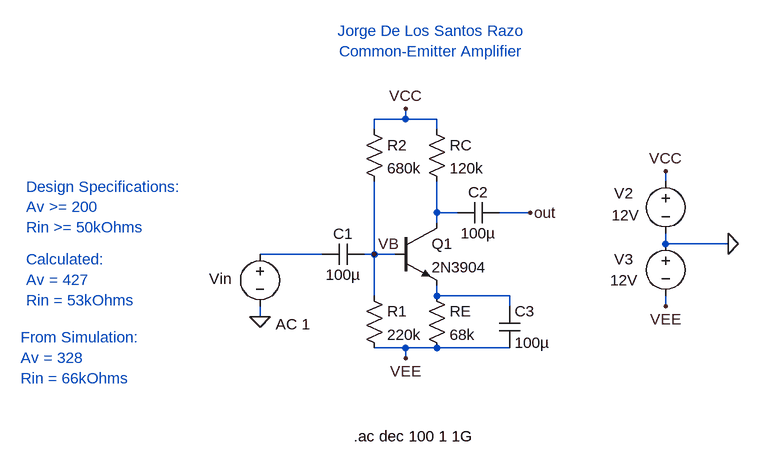
[diagram p0: schematic ce-amplifier.asc]
ce-amplifier.asc, the LTspice schematic file:
Version 4.1
SHEET 1 880 680
WIRE 208 -80 208 -96
WIRE 208 -80 160 -80
WIRE 256 -80 208 -80
WIRE 160 -64 160 -80
WIRE 256 -64 256 -80
WIRE 608 16 608 0
WIRE 256 64 256 16
WIRE 288 64 256 64
WIRE 400 64 352 64
WIRE 256 80 256 64
WIRE 608 112 608 96
WIRE 704 112 608 112
WIRE 80 128 -16 128
WIRE 160 128 160 16
WIRE 160 128 144 128
WIRE 192 128 160 128
WIRE 160 192 160 128
WIRE 256 192 256 176
WIRE 368 192 256 192
WIRE 368 208 368 192
WIRE 608 208 608 192
WIRE -16 224 -16 208
WIRE 208 272 160 272
WIRE 256 272 208 272
WIRE 368 272 256 272
WIRE 208 288 208 272
FLAG -16 224 0
FLAG 208 -96 VCC
FLAG 208 288 VEE
FLAG 608 0 VCC
FLAG 608 208 VEE
FLAG 704 112 0
FLAG 400 64 out
FLAG 160 128 VB
SYMBOL npn 192 80 R0
SYMATTR InstName Q1
SYMATTR Value 2N3904
SYMBOL res 240 -80 R0
SYMATTR InstName RC
SYMATTR Value 120k
SYMBOL res 240 176 R0
SYMATTR InstName RE
SYMATTR Value 68k
SYMBOL res 144 176 R0
SYMATTR InstName R1
SYMATTR Value 220k
SYMBOL res 144 -80 R0
SYMATTR InstName R2
SYMATTR Value 680k
SYMBOL cap 144 112 R90
WINDOW 0 0 32 VBottom 2
WINDOW 3 32 32 VTop 2
SYMATTR InstName C1
SYMATTR Value 100µ
SYMBOL voltage -16 112 R0
WINDOW 0 -78 54 Left 2
WINDOW 123 24 124 Left 2
WINDOW 39 0 0 Left 0
SYMATTR InstName Vin
SYMATTR Value2 AC 1
SYMATTR Value ""
SYMBOL cap 352 48 R90
WINDOW 0 0 32 VBottom 2
WINDOW 3 32 32 VTop 2
SYMATTR InstName C2
SYMATTR Value 100µ
SYMBOL voltage 608 0 R0
WINDOW 0 -79 34 Left 2
WINDOW 3 -83 68 Left 2
SYMATTR InstName V2
SYMATTR Value 12V
SYMBOL voltage 608 96 R0
WINDOW 0 -79 40 Left 2
WINDOW 3 -85 72 Left 2
SYMATTR InstName V3
SYMATTR Value 12V
SYMBOL cap 352 208 R0
SYMATTR InstName C3
SYMATTR Value 100µ
TEXT 248 -200 Center 2 ;Jorge De Los Santos Razo\nCommon-Emitter Amplifier
TEXT -376 24 Left 2 ;Design Specifications:\nAv >= 200\nRin >= 50kOhms
TEXT -376 136 Left 2 ;Calculated:\nAv = 427\nRin = 53kOhms
TEXT -384 256 Left 2 ;From Simulation:\nAv = 328\nRin = 66kOhms
TEXT 128 408 Left 2 !.ac dec 100 1 1G

The netlist it stands for:
* ce-amplifier.asc
Q1 N001 VB N003 0 2N3904
RC VCC N001 120k
RE N003 VEE 68k
R1 VB VEE 220k
R2 VCC VB 680k
C1 VB N002 100µ
Vin N002 0 AC 1
C2 out N001 100µ
V2 VCC 0 12V
V3 0 VEE 12V
C3 N003 VEE 100µ
.model NPN NPN
.model PNP PNP
.lib standard.bjt
* Jorge De Los Santos Razo
* Common-Emitter Amplifier
* Design Specifications:
* Av >= 200
* Rin >= 50kOhms
* Calculated:
* Av = 427
* Rin = 53kOhms
* From Simulation:
* Av = 328
* Rin = 66kOhms
.ac dec 100 1 1G
.backanno
.end